# Altium schematic sheet Oscar_MainBoard_WIFI.SchDoc
size A4
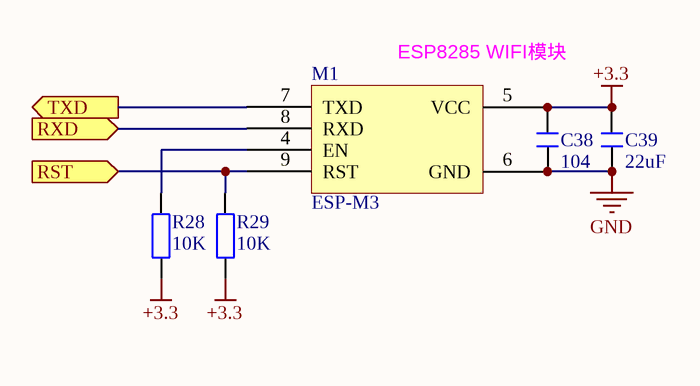
[diagram p0: Oscar_MainBoard_WIFI.SchDoc]

## Parts
C38  104  [C 0402_L]
C39  22uF  [C 0805_L]
M1  ESP-M3  [ESP-M3]
R28  10K  [R 0402_L]
R29  10K  [R 0402_L]

## Ports
RST (in), RXD (in), TXD (out)

## Nets
+3.3: C38.2 C39.2 M1.5(VCC) R28.1 R29.1
GND: C38.1 C39.1 M1.6(GND)
RST: M1.9(RST) R29.2 ; port RST
RXD: M1.8(RXD) ; port RXD
TXD: M1.7(TXD) ; port TXD
NetM1_4: M1.4(EN) R28.2

## Notes on the sheet
- ESP8285 WIFI模块

## Library data of the parts
C38 C39 = C: 贴片电容; BOM名称: 无极性贴片电容; 优秀评价可免费更新: 联系淘宝ID：黄晶宝石，获取更新版封装库; 卖家免费技术支持，联系售后: 唯一出售店铺网址https://shop463601444.taobao.com; 本封装库来自淘宝卖家 ID：黄晶宝石: 其他店铺购入均为盗版，请立即申请退款
M1 = ESP-M3: 四博智联ESP-M3无线模块
R28 R29 = R: 贴片电阻; 优秀评价可免费更新: 联系淘宝ID：黄晶宝石，获取更新版封装库; 卖家免费技术支持，联系售后: 唯一出售店铺网址https://shop463601444.taobao.com; 本封装库来自淘宝卖家 ID：黄晶宝石: 其他店铺购入均为盗版，请立即申请退款; BOM名称: 贴片电阻